# EAGLE design splitnblend (EAGLE 7.5.0)
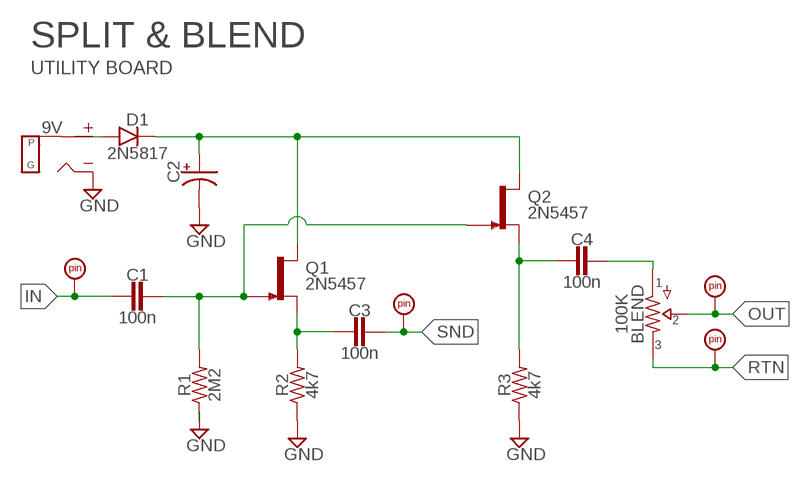
[diagram p0: schematic, sheet 1]

## Parts
9V  DC_MONO  [DC]
BLEND  100K  POTS16MM  [16MM]
C1  100n  CER/FILM2  [050X030_025_2]
C2  0501  [050_020_1]
C3  100n  CER/FILM2  [050X030_025_2]
C4  100n  CER/FILM2  [050X030_025_2]
D1  2N5817  DO41.3  [DO41-3]
IN  PADSQR  [SQUARE]
OUT  PADSQR  [SQUARE]
Q1  2N5457  [TO92-]
Q2  2N5457  [TO92-]
R1  2M2  R_.3B  [R0207/3]
R2  4k7  R_.3B  [R0207/3]
R3  4k7  R_.3B  [R0207/3]
RTN  PADSQR  [SQUARE]
SND  PADSQR  [SQUARE]

## Nets
GND: 9V.S(SLEEVE) C2.- R1.1 R2.1 R3.1
IN: C1.2 IN.1
N$1: 9V.T(TIP) D1.A
N$2: C2.+ D1.C Q1.3(D) Q2.3(D)
N$3: C3.2 Q1.2(S) R2.2
N$4: C1.1 Q1.1(G) Q2.1(G) R1.2
N$5: C4.2 Q2.2(S) R3.2
N$6: BLEND.1 C4.1
OUT: BLEND.2 OUT.1
RTN: BLEND.3 RTN.1
SND: C3.1 SND.1

## Notes on the sheet
- SPLIT & BLEND
- UTILITY BOARD

## Library data of the parts
9V = jacks:DC_MONO
BLEND = potentiometers:POTS
C1 C3 C4 = capacitors-film:CER/FILM: 47 - 120pF Xicon Ceramic Disc 2.5mm lead spacing
C2 = capacitors-elec:050: 0.22 - 100uF Xicon values at Mouser.com: 10V: 10 - 100uF; 16V: 2.2 - 47uF; 25V: 0.47 - 47uF; 50V: 0.22 - 22uF
D1 = diodes:DO41: DO-41 Package Diodes: 1N4001 - 1N40019 Zener Diodes: 1N4728 - 1N4764
IN OUT RTN SND = supply pins:PAD
Q1 Q2 = transistors:2N5457: N-CHANNEL JFET
R1-R3 = resistors:R_

## Board
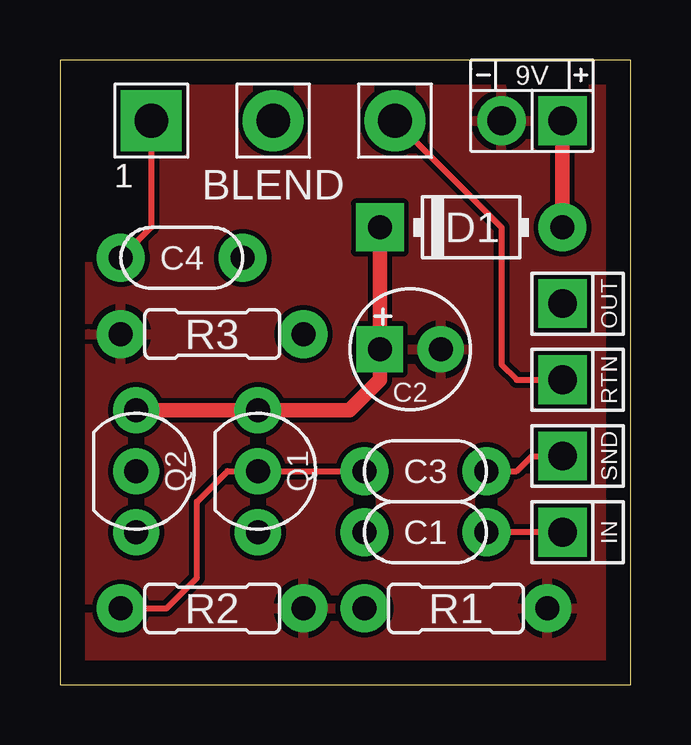
[diagram p1: board, top side]
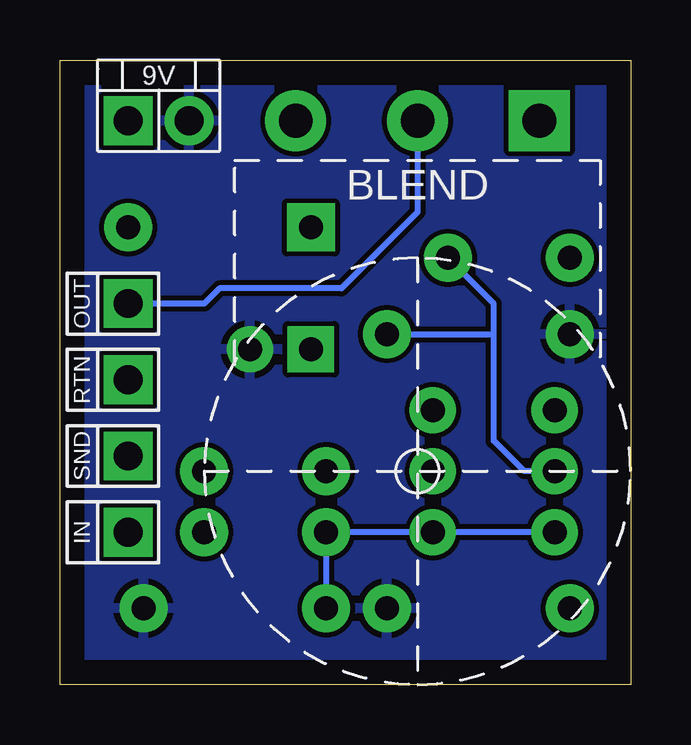
[diagram p2: board, bottom side, seen from below]

Size 23.8 x 26.02 mm. Coordinates in mm from the lower left corner, seen from the top.
Outline: 0,0 23.8,0 23.8,26.02 0,26.02 0,0
Copper layers (1*16): Top 0.035mm / dielectric 1.5mm / Bottom 0.035mm
Design rules "default": minimum track width 10mil, minimum drill 24mil, track to track 8mil, track to pad 8mil, pad to pad 8mil, via to via 8mil, smd to smd 8mil, copper to edge 40mil, drill to drill 8mil, minimum pad ring 10mil, minimum via ring 8mil, stop-mask expansion 4mil, vias tented up to drill 0mil, thermal gap 10mil

### Footprints (pad centres in the part's own frame; a part is rotated, then mirrored left to right if it is on the bottom)
DC = drill 1.2 pad 2.032: S -1.27,0 | drill 1.2 pad 2.032 square: T 1.27,0
16MM = drill 1.4 pad 2.54 square: 1 5.08,0 | drill 1.4 pad 2.54: 2 0,0; 3 -5.08,0
050X030_025_2 = drill 1 pad 2: 1 -2.54,0; 2 2.54,0
050_020_1 = drill 1 pad 1.93 square: + -1.27,0 | drill 1 pad 1.93: - 1.27,0
DO41-3 = drill 1 pad 2: A 3.81,0 | drill 1 pad 2 square: C -3.81,0
SQUARE = drill 1.2 pad 2.032 square: 1 0,0
TO92- = drill 1 pad 1.93: 1 2.54,0; 2 0,0; 3 -2.54,0
R0207/3 = drill 1 pad 2: 1 -3.81,0; 2 3.81,0

### Placement (x,y rotation side)
9V  19.68,23.5 0 top
BLEND  8.89,23.5 180 top
C1  15.24,6.35 0 top
C2  14.61,13.97 0 top
C3  15.24,8.89 180 top
C4  5.08,17.78 0 top
D1  17.14,19.05 0 top
IN  20.95,6.35 90 top
OUT  20.95,15.88 90 top
Q1  8.26,8.89 270 top
Q2  3.17,8.89 270 top
R1  16.51,3.17 180 top
R2  6.35,3.17 180 top
R3  6.35,14.61 0 top
RTN  20.95,12.7 90 top
SND  20.95,9.53 90 top

### Tracks (layer width: path | path; a pad name or v marks a point on that pad's centre or on a via)
GND
  pour Bottom: 0.64,25.4 22.86,25.4 22.86,0.64 0.64,0.64
  pour Top: 0.64,25.4 22.86,25.4 22.86,0.64 0.64,0.64
IN
  Top 0.254: IN.1 C1.2
N$1
  Top 0.61: 9V.T D1.A
N$2
  Top 0.61: D1.C C2.+ 13.34,12.7 12.06,11.43 Q1.3 Q2.3
N$3
  Top 0.254: C3.2 Q1.2 6.99,8.89 5.71,7.62 5.71,4.45 4.45,3.17 R2.2
N$4
  Bottom 0.254: Q2.1 Q1.1 C1.1 R1.2
N$5
  Bottom 0.254: Q2.2 4.45,8.89 5.71,10.16 5.71,14.61 | 5.71,14.61 5.71,15.88 C4.2 | R3.2 5.71,14.61
N$6
  Top 0.254: BLEND.1 3.81,19.05 C4.1
OUT
  Bottom 0.254: BLEND.2 8.89,19.68 12.06,16.51 17.14,16.51 17.78,15.88 OUT.1
RTN
  Top 0.254: BLEND.3 18.41,19.05 18.41,13.34 19.05,12.7 RTN.1
SND
  Top 0.254: C3.1 19.05,8.89 19.68,9.53 SND.1